# EAGLE design 20210410-JGaylord-Exprsn_MIDI (EAGLE 9.6.2)
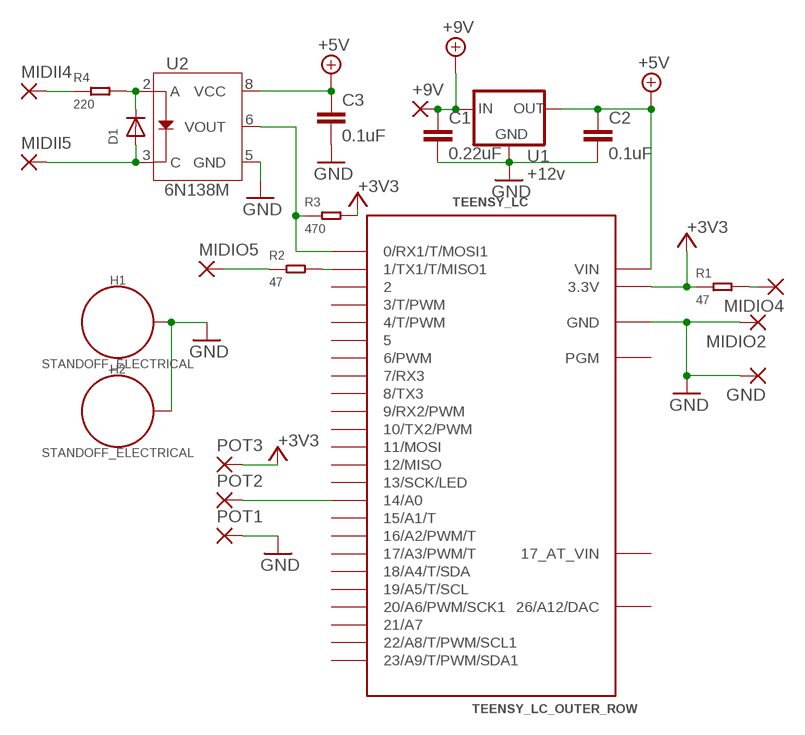
[diagram p0: schematic, sheet 1]

## Parts
+9V  WIREPAD2,15/1,0  [2,15/1,0]
C1  0.22uF  0.22UF-0603-25V-10%  [0603]
C2  0.1uF  0.1UF-0603-25V-(+80/-20%)  [0603]
C3  0.1uF  0.1UF-0603-25V-(+80/-20%)  [0603]
D1  DIODESOD-123  [SOD-123]
GND  WIREPAD2,15/1,0  [2,15/1,0]
H1  STANDOFF_ELECTRICAL  [STANDOFF-ELECTRICAL]
H2  STANDOFF_ELECTRICAL  [STANDOFF-ELECTRICAL]
MIDII4  WIREPAD2,15/1,0  [2,15/1,0]
MIDII5  WIREPAD2,15/1,0  [2,15/1,0]
MIDIO2  WIREPAD2,15/1,0  [2,15/1,0]
MIDIO4  WIREPAD2,15/1,0  [2,15/1,0]
MIDIO5  WIREPAD2,15/1,0  [2,15/1,0]
POT1  WIREPAD2,15/1,0  [2,15/1,0]
POT2  WIREPAD2,15/1,0  [2,15/1,0]
POT3  WIREPAD2,15/1,0  [2,15/1,0]
R1  47  SMD-RES-0R-1%-1/8W(0805)  [R0805]
R2  47  SMD-RES-0R-1%-1/8W(0805)  [R0805]
R3  470  SMD-RES-0R-1%-1/8W(0805)  [R0805]
R4  220  SMD-RES-0R-1%-1/8W(0805)  [R0805]
TEENSY_LC  TEENSY_LC_OUTER_ROW  [TEENSY_3.0-3.2&LC_OUTER_ROW]
U1  +12v  V_REG_78XX7812  [TO-252]
U2  6N138M  OPTO_DARL_6N138S  [8-SMD]

## Nets
+3V3: POT3.1(P) R1.1 R3.2 TEENSY_LC.3.3V TEENSY_LC.3.3V1(3.3V)
+5V: C2.1 C3.1 TEENSY_LC.VIN U1.2(OUT) U2.8(VCC)
+9V: +9V.1(P) C1.1 U1.1(IN)
GND: C1.2 C2.2 C3.2 GND.1(P) H1.P1 H2.P1 MIDIO2.1(P) POT1.1(P) TEENSY_LC.AGND(GND) TEENSY_LC.GND TEENSY_LC.GND1(GND) U1.3(GND) U2.5(GND)
N$2: R2.2 TEENSY_LC.1(1/TX1/T/MISO1)
N$3: MIDIO5.1(P) R2.1
N$4: POT2.1(P) TEENSY_LC.14/A0
N$5: R3.1 TEENSY_LC.0(0/RX1/T/MOSI1) U2.6(VOUT)
N$6: D1.C R4.2 U2.2(A)
N$7: MIDIO4.1(P) R1.2
N$8: D1.A MIDII5.1(P) U2.3(C)
N$9: MIDII4.1(P) R4.1
Unconnected: TEENSY_LC.2 TEENSY_LC.3(3/T/PWM) TEENSY_LC.4(4/T/PWM) TEENSY_LC.5 TEENSY_LC.6(6/PWM) TEENSY_LC.7(7/RX3) TEENSY_LC.8(8/TX3) TEENSY_LC.9(9/RX2/PWM) TEENSY_LC.10(10/TX2/PWM) TEENSY_LC.11(11/MOSI) TEENSY_LC.12(12/MISO) TEENSY_LC.13(13/SCK/LED) TEENSY_LC.15/A1(15/A1/T) TEENSY_LC.16/A2(16/A2/PWM/T) TEENSY_LC.17/A3(17/A3/PWM/T) TEENSY_LC.18/A4(18/A4/T/SDA) TEENSY_LC.19/A5(19/A5/T/SCL) TEENSY_LC.20/A6(20/A6/PWM/SCK1) TEENSY_LC.21/A7 TEENSY_LC.22/A8(22/A8/T/PWM/SCL1) TEENSY_LC.23/A9(23/A9/T/PWM/SDA1) TEENSY_LC.PGM TEENSY_LC.VBAT(17_AT_VIN)

## Power pins joined to a net without a drawn wire
26/A12/DAC: TEENSY_LC.RESET/DAC(26/A12/DAC)

## Library data of the parts
+9V GND MIDII4 MIDII5 MIDIO2 MIDIO4 MIDIO5 POT1-POT3 = wirepad:WIREPAD: Wire PAD connect wire on PCB
C1 = SparkFun-Capacitors:0.22UF: 0.22µF ceramic capacitors A capacitor is a passive two-terminal electrical component used to store electrical energy temporarily in an electric field.; PROD_ID: CAP-07822
C2 C3 = SparkFun-Capacitors:0.1UF: 0.1µF ceramic capacitors A capacitor is a passive two-terminal electrical component used to store electrical energy temporarily in an electric field.; PROD_ID: CAP-00810
D1 = adafruit:DIODE: Diode SMADIODE - SMA Surface Mount Package 20V 1A Schottky Diode Digikey: 641-1014-6-ND DO-1N4148 - Through Hole Small Current Diode SOD-123 20V 1 A (.5mV Vf) Schottky Diode - Digikey: MBRX120TPMSCT-ND SOD-323 10V 570mA (.38mV Vf, 3ns) Schottky Diode - Digikey: ZLLS410CT-ND SOD-523 30V 30mA Schottky Diode (RB751S-40TE61) - Digikey: RB751S-40TE61CT-ND SOT23-R/W - SOT23 Package (R = Solder Paste/Reflow Ovens, W = Hand-Soldering) BAT54Film 40V 300mA - Digikey: 497-7162-1-ND
H1 H2 = SparkFun-Hardware:STANDOFF_ELECTRICAL: Stand Off Drill holes with an electrical connection. For example, use these to ground your board to a chassis. Example SparkFun Products Screw - Phillips Head (1/4", 4-40, 10 pack) <https://www.sparkfun.com/products/10453> (PRT-10453) Screw - Phillips Head (1/2", 4-40, 10 pack) <https://www.sparkfun.com/products/10452> (PRT-10452) Screw - Phillips Head (3/4", 4-40, 10 pack) <https://www.sparkfun.com/products/10451> (PRT-10451) Screw - Phillips Head (1", 4-40, 10 pack) <https://www.sparkfun.com/products/10450> (PRT-10450)
R1-R4 = OPL_Resistor:SMD-RES-0R-1%-1/8W(0805): 301012149; MPN: RC0805JR-071KL; VALUE: 1K
TEENSY_LC = Teensy_3_and_LC_Series_Boards_v1.4:TEENSY_LC_OUTER_ROW: Teensy LC with only outer row of pins.
U1 = SparkFun-IC-Power:V_REG_78XX: Voltage Regulator Standard 78xx regulator. IGO (Input Ground Output). Spark Fun Electronics SKU : COM-00107; PROD_ID: VREG-12370
U2 = SparkFun-DiscreteSemi:OPTO_DARL_6N138S: Optoisolator, darlington pair output Optocoupler consisting of an AlGaAs LED optically coupled to a high gain split darlington photodetector. SparkFun Products: SparkFun MIDI Shield <https://www.sparkfun.com/products/12898>; PROD_ID: IC-09482

## Board
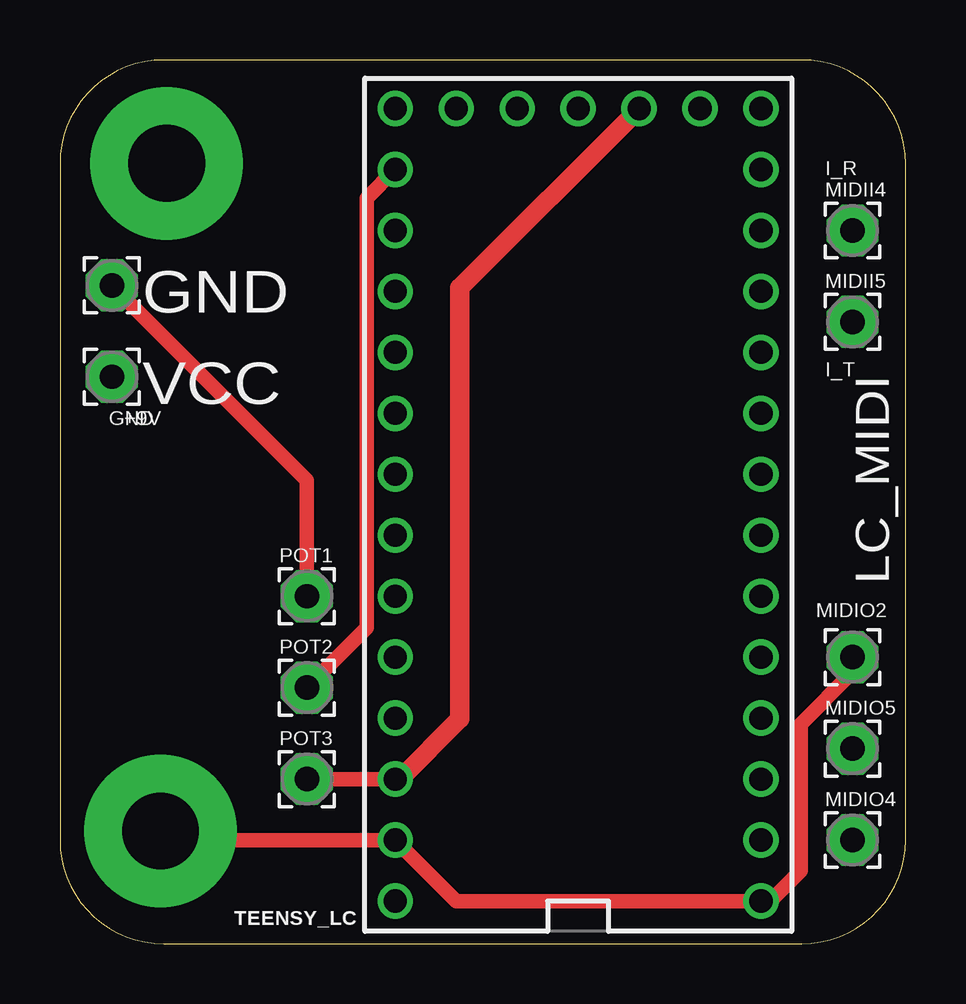
[diagram p1: board, top side]
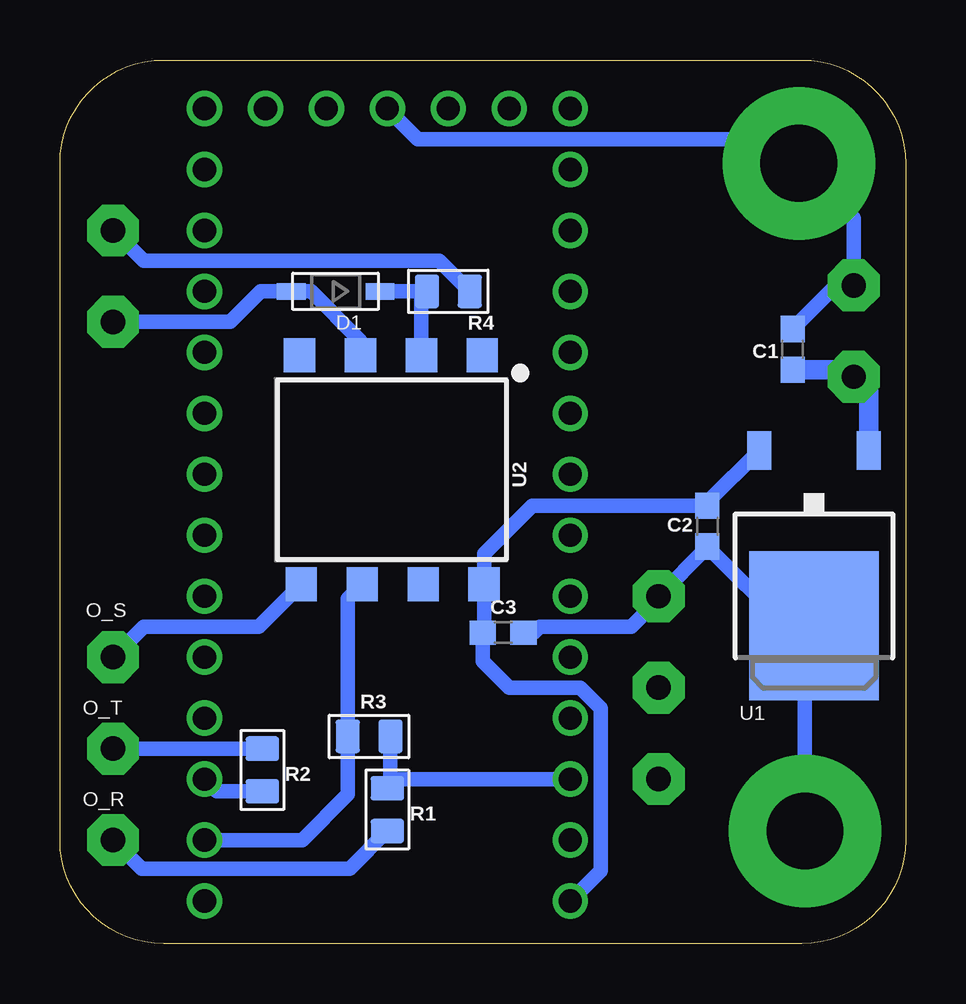
[diagram p2: board, bottom side, seen from below]

Size 35.23 x 36.82 mm. Coordinates in mm from the lower left corner, seen from the top.
Outline: 35.23,4.32 35.23,32.5 arc90 30.91,36.82 4.32,36.82 arc90 0,32.5 0,4.32 arc90 4.32,0 30.91,0 arc90 35.23,4.32
Copper layers (1*16): Top 0.035mm / dielectric 1.5mm / Bottom 0.035mm
Design rules "default": minimum track width 6mil, minimum drill 0.35mm, track to track 6mil, track to pad 6mil, pad to pad 6mil, via to via 6mil, smd to smd 6mil, copper to edge 40mil, drill to drill 6mil, minimum pad ring 10mil, minimum via ring 8mil, stop-mask expansion 4mil, vias tented up to drill 0mil, thermal gap 10mil

### Footprints (pad centres in the part's own frame; a part is rotated, then mirrored left to right if it is on the bottom)
2,15/1,0 = drill 1.016 pad 2.159 octagon: 1 0,0
0603 = smd 1.1 x 1: 1 -0.85,0; 2 0.85,0
SOD-123 = smd 1.2 x 0.7: A 1.85,0; C -1.85,0
STANDOFF-ELECTRICAL = drill 3.2 pad 6.35: P1 0,0
R0805 = smd 1.397 x 1.016: 1 0,0.889; 2 0,-0.889
TEENSY_3.0-3.2&LC_OUTER_ROW = drill 0.965: 0 -7.62,13.97; 1 -7.62,11.43; 2 -7.62,8.89; 3 -7.62,6.35; 3.3V 7.62,11.43; 3.3V1 -2.54,-16.51; 4 -7.62,3.81; 5 -7.62,1.27; 6 -7.62,-1.27; 7 -7.62,-3.81; 8 -7.62,-6.35; 9 -7.62,-8.89; 10 -7.62,-11.43; 11 -7.62,-13.97; 12 -7.62,-16.51; 13 7.62,-16.51; 14/A0 7.62,-13.97; 15/A1 7.62,-11.43; 16/A2 7.62,-8.89; 17/A3 7.62,-6.35; 18/A4 7.62,-3.81; 19/A5 7.62,-1.27; 20/A6 7.62,1.27; 21/A7 7.62,3.81; 22/A8 7.62,6.35; 23/A9 7.62,8.89; AGND 7.62,13.97; GND -7.62,16.51; GND1 0,-16.51; PGM 2.54,-16.51; RESET/DAC 5.08,-16.51; VBAT -5.08,-16.51; VIN 7.62,16.51
TO-252 = smd 1 x 1.6: 1 -2.28,-4.8; 2 2.28,-4.8 | smd 5.4 x 6.2: 3 0,2.5
8-SMD = smd 1.3 x 1.4: 1 -3.96,-4.96; 2 -1.42,-4.96; 3 1.12,-4.96; 4 3.66,-4.96; 5 3.59,4.58; 6 1.05,4.58; 7 -1.49,4.58; 8 -4.03,4.58

### Placement (x,y rotation side)
+9V  2.16,23.62 0 top
C1  4.7,24.77 90 bottom
C2  8.26,17.4 270 bottom
C3  16.76,12.95 0 bottom
D1  23.75,27.18 180 bottom
GND  33.02,11.94 0 top
H1  4.19,4.7 0 top
H2  4.45,32.51 0 top
MIDII4  33.02,29.72 0 top
MIDII5  33.02,25.91 0 top
MIDIO2  2.16,27.43 0 top
MIDIO4  33.02,4.32 0 top
MIDIO5  33.02,8.13 0 top
POT1  10.29,14.48 0 top
POT2  10.29,10.67 0 top
POT3  10.29,6.86 0 top
R1  21.59,5.59 0 bottom
R2  26.8,7.24 0 bottom
R3  22.35,8.64 90 bottom
R4  19.05,27.18 270 bottom
TEENSY_LC  21.59,18.29 180 top
U1  3.81,15.75 180 bottom
U2  21.59,19.56 180 bottom

### Tracks (layer width: path | path; a pad name or v marks a point on that pad's centre or on a via)
+3V3
  Top 0.61: POT3.1 TEENSY_LC.3.3V
  Top 0.813: TEENSY_LC.3.3V1 16.66,27.33 16.66,9.37 14.15,6.86 TEENSY_LC.3.3V
  Bottom 0.61: R3.2 21.46,6.6 R1.1 21.21,6.86 TEENSY_LC.3.3V
+5V
  Bottom 0.61: U1.2 8.26,18.38 C2.1 15.56,18.25 17.56,16.25 U2.8 17.56,13.01 C3.1 17.61,11.77 16.51,10.67 13.55,10.67 12.7,9.82 12.7,3.05 TEENSY_LC.VIN
+9V
  Bottom 0.813: U1.1 1.53,22.99 +9V.1 2.45,23.91 C1.1
GND
  Top 0.61: H1.P1 4.57,4.32 TEENSY_LC.AGND 16.51,1.78 TEENSY_LC.GND 29.59,1.78 30.86,3.05 30.86,9.14 33.02,11.3 GND.1 | MIDIO2.1 10.29,19.3 POT1.1
  Bottom 0.61: GND.1 31.75,13.21 26.95,13.21 U2.5 | C3.2 15.49,12.95 15.24,13.21 11.43,13.21 10.29,14.35 POT1.1 8.26,16.51 C2.2 4.95,13.25 U1.3 4.19,12.87 H1.P1 | C1.2 2.88,27.43 MIDIO2.1 2.16,30.23 H2.P1 5.46,33.53 20.32,33.53 TEENSY_LC.GND1
N$2
  Bottom 0.61: R2.2 28.7,6.35 TEENSY_LC.1
N$3
  Bottom 0.61: R2.1 MIDIO5.1
N$4
  Top 0.61: POT2.1 12.78,13.16 12.78,31.06 TEENSY_LC.14/A0
N$5
  Bottom 0.61: TEENSY_LC.0 25.15,4.32 23.24,6.22 R3.1 23.24,14.38 U2.6
N$6
  Bottom 0.61: D1.C R4.2 20.17,26.95 U2.2
N$7
  Bottom 0.61: MIDIO4.1 31.83,3.12 23.16,3.12 R1.2
N$8
  Bottom 0.61: U2.3 22.71,25.12 24.77,27.18 D1.A 26.87,27.18 28.14,25.91 MIDII5.1
N$9
  Bottom 0.61: R4.1 18.97,27.99 | 18.97,27.99 | 18.97,27.99 19.43,28.45 31.75,28.45 MIDII4.1

### Text on the board
tPlace: I_R | GND | I_T | VCC | LC_MIDI
bPlace: O_S | O_T | O_R